# Altium project PCB_Project1.PrjPCB
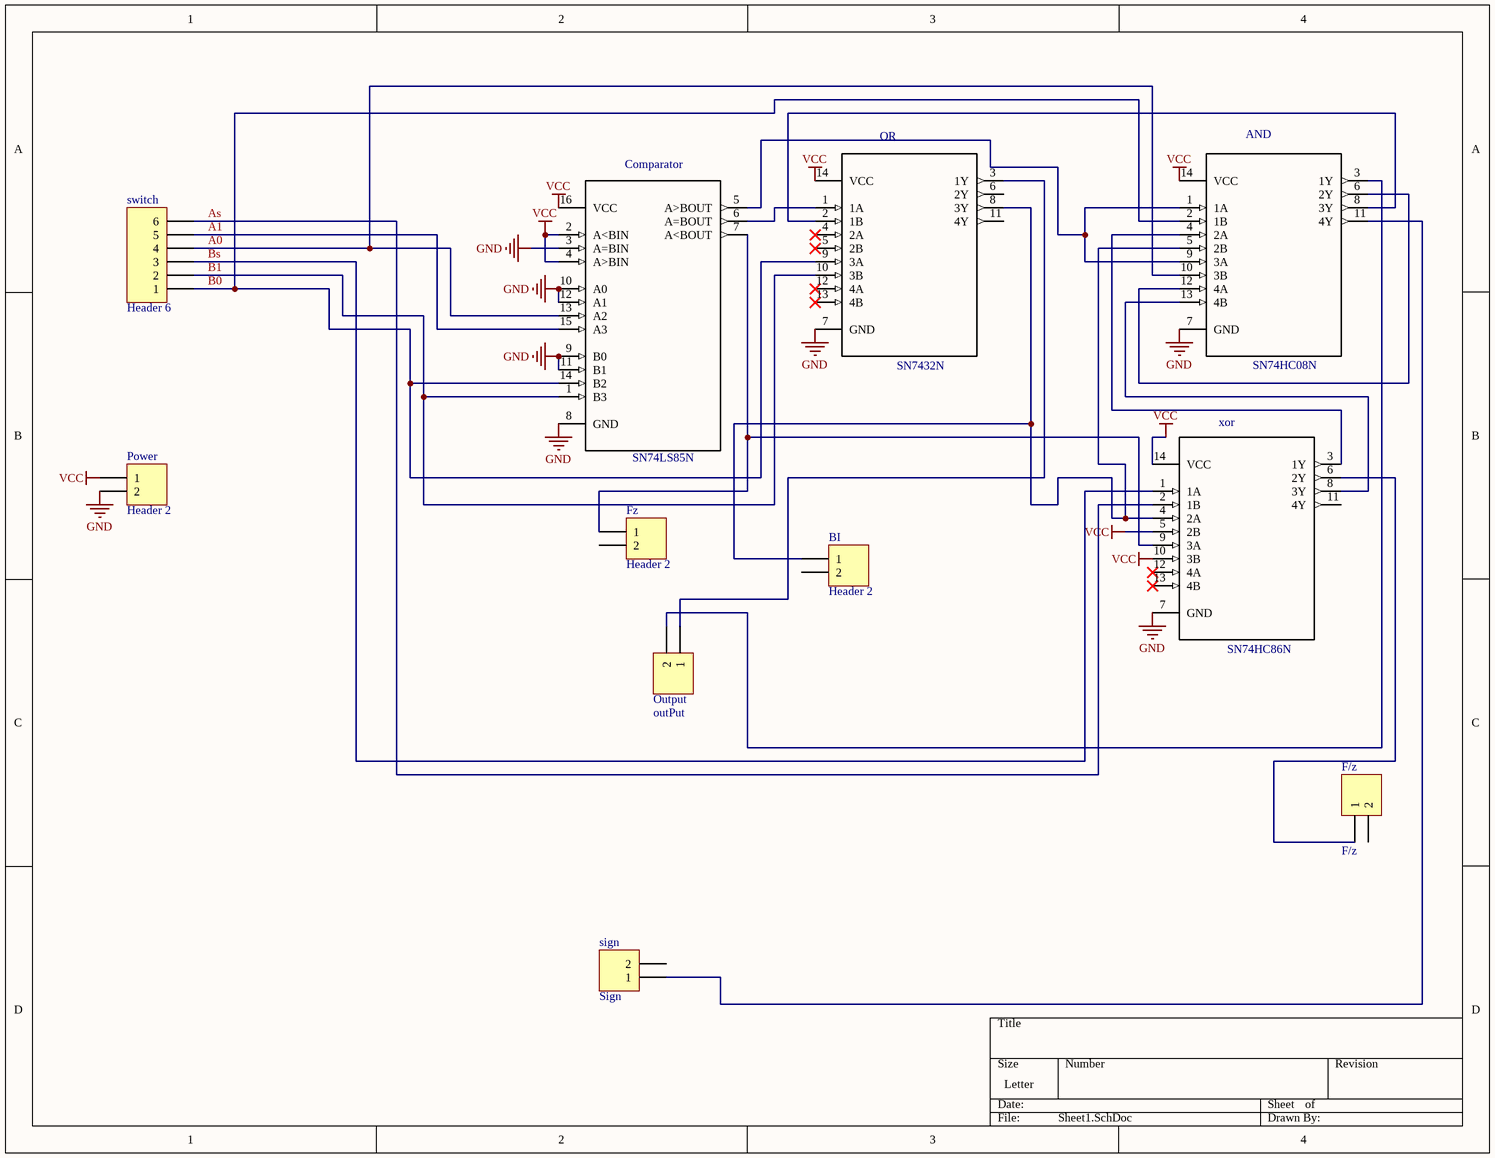
[diagram p0: Sheet1.SchDoc]
1 sheet, 11 parts. Net scope: global (net labels, ports and power ports of the same name join across sheets).
Board file: PCB1.PcbDoc

## Sheet Sheet1.SchDoc
size Letter

### Parts
AND  SN74HC08N  [DIP254P762X508-14]
BI  Header 2  [HDR1X2]
Comparator  SN74LS85N  [DIP254P762X508-16]
F/z  F/z  [HDR1X2]
Fz  Header 2  [HDR1X2]
OR  SN7432N  [DIP254P762X508-14]
Output  outPut  [HDR1X2]
Power  Header 2  [HDR1X2]
sign  Sign  [HDR1X2]
switch  Header 6  [HDR1X6]
xor  SN74HC86N  [DIP254P762X508-14]

### Nets
GND: AND.7(GND) Comparator.3(A=BIN) Comparator.8(GND) Comparator.9(B0) Comparator.10(A0) Comparator.11(B1) Comparator.12(A1) OR.7(GND) Power.2 xor.7(GND)
VCC: AND.14(VCC) Comparator.2(A<BIN) Comparator.4(A>BIN) Comparator.16(VCC) OR.14(VCC) Power.1 xor.5(2B) xor.10(3B) xor.14(VCC)
NetAND_1: AND.1(1A) AND.9(3A) Comparator.5(A>BOUT)
NetAND_2: AND.2(1B) Comparator.14(B2) OR.9(3A) switch.1
NetAND_3: AND.3(1Y) Output.2
NetAND_4: AND.4(2A) xor.3(1Y)
NetAND_5: AND.5(2B) BI.1 OR.8(3Y) xor.4(2A)
NetAND_6: AND.6(2Y) AND.12(4A)
NetAND_8: AND.8(3Y) OR.2(1B)
NetAND_10: AND.10(3B) Comparator.13(A2) switch.4
NetAND_11: AND.11(4Y) sign.1
NetAND_13: AND.13(4B) xor.8(3Y)
NetComparator_1: Comparator.1(B3) OR.10(3B) switch.2
NetComparator_6: Comparator.6(A=BOUT) OR.1(1A)
NetComparator_7: Comparator.7(A<BOUT) Fz.1 xor.9(3A)
NetComparator_15: Comparator.15(A3) switch.5
NetF/z_1: F/z.1 xor.6(2Y)
NetOR_3: OR.3(1Y) Output.1
Netswitch_3: switch.3 xor.1(1A)
Netswitch_6: switch.6 xor.2(1B)

Not connected (* = marked no-connect by the designer): BI 2; F/z 2; Fz 2; OR 4(2A)* 5(2B)* 6(2Y) 11(4Y) 12(4A)* 13(4B)*; sign 2; xor 11(4Y) 12(4A)* 13(4B)*

### Notes on the sheet
- (near switch) As
- (near switch) A1
- (near switch) A0
- (near switch) Bs
- (near switch) B1
- (near switch) B0

### Library data of the parts
AND = SN74HC08N: MF: Texas Instruments; Availability: Unavailable; Price: None; SnapEDA_Link: https://www.snapeda.com/parts/SN74HC08N/Texas%20Instruments/view-part/?ref=snap; Package: PDIP-14 Signetics; MP: SN74HC08N; Value: *
BI F/z Fz Output Power sign = Header 2: Header, 2-Pin; LatestRevisionDate: 17-Jul-2002; LatestRevisionNote: Re-released for DXP Platform.; Publisher: Altium Limited
Comparator = SN74LS85N: Logic - Digital Comparators 4-bit binary or BCD Magnitude Comparator; MF: Texas Instruments; Package: DIP-16 Texas Instruments; MP: SN74LS85N; Price: None; Availability: Unavailable; SnapEDA_Link: https://www.snapeda.com/parts/SN74LS85N/Texas%20Instruments/view-part/?ref=snap; Value: *
OR = SN7432N: OR Gate 4-Element 2-IN Bipolar 14-Pin PDIP Tube; MF: Texas Instruments; Digi-Key_Purchase_URL: https://www.digikey.com.eg/product-detail/en/texas-instruments/SN7432N/296-33610-5-ND/1575185?utm_source=snapeda&utm_medium=aggregator&utm_campaign=symbol; SnapEDA_Link: https://www.snapeda.com/parts/SN7432N/Texas%20Instruments/view-part/?ref=snap; MP: SN7432N; Package: DIP-14 Texas Instruments; Digi-Key_Part_Number: 296-33610-5-ND; Value: *
switch = Header 6: Header, 6-Pin; LatestRevisionDate: 17-Jul-2002; LatestRevisionNote: Re-released for DXP Platform.; Publisher: Altium Limited
xor = SN74HC86N: IC: digital; inverter; XOR; Channels: 4; THT; DIP14; Series: HC; MF: Texas Instruments; SnapEDA_Link: https://www.snapeda.com/parts/SN74HC86N/Texas%20Instruments/view-part/?ref=snap; Package: SOP-14 Texas Instruments; MP: SN74HC86N; Price: None; Availability: Unavailable; Value: *